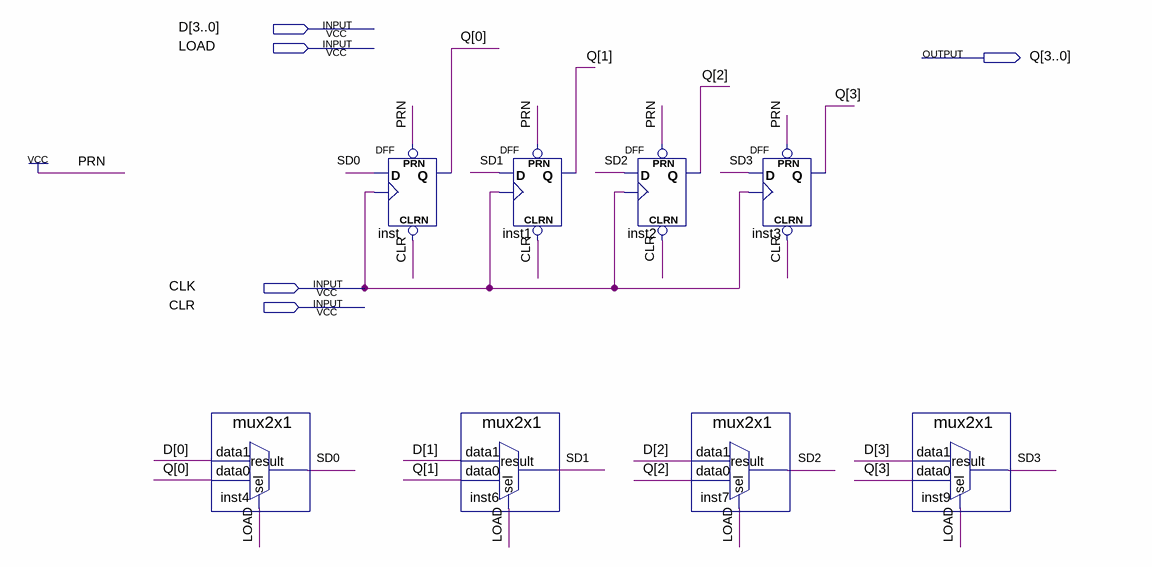
[diagram p0: schematic sheet]
// Quartus schematic reg4bits.bdf as structural Verilog: 8 symbols, 5 pins
module reg4bits (
  input  [3:0] D,
  input  LOAD,
  input  CLK,
  input  CLR,
  output [3:0] Q
);

  wire SD0, SD1, SD2, SD3;

  mux2x1 inst4 (.data1(D[0]), .data0(Q[0]), .sel(LOAD), .result(SD0));
  DFF inst (.CLRN(CLR), .CLK(CLK), .D(SD0), .PRN(1'b1), .Q(Q[0]));
  mux2x1 inst6 (.data1(D[1]), .data0(Q[1]), .sel(LOAD), .result(SD1));
  DFF inst1 (.CLRN(CLR), .CLK(CLK), .D(SD1), .PRN(1'b1), .Q(Q[1]));
  DFF inst2 (.CLRN(CLR), .CLK(CLK), .D(SD2), .PRN(1'b1), .Q(Q[2]));
  mux2x1 inst7 (.data1(D[2]), .data0(Q[2]), .sel(LOAD), .result(SD2));
  DFF inst3 (.CLRN(CLR), .CLK(CLK), .D(SD3), .PRN(1'b1), .Q(Q[3]));
  mux2x1 inst9 (.data1(D[3]), .data0(Q[3]), .sel(LOAD), .result(SD3));
endmodule
